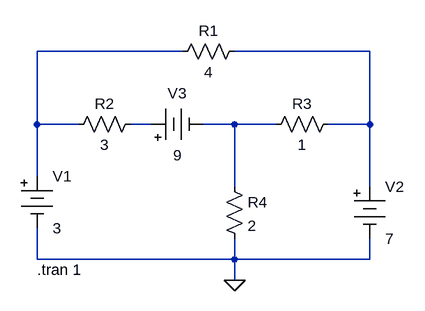
[diagram p0: schematic g3_p3.asc]
g3_p3.asc, the LTspice schematic file:
Version 4
SHEET 1 880 680
WIRE 176 -16 -48 -16
WIRE 464 -16 256 -16
WIRE -48 96 -48 -16
WIRE 16 96 -48 96
WIRE 128 96 96 96
WIRE 256 96 208 96
WIRE 320 96 256 96
WIRE 464 96 464 -16
WIRE 464 96 400 96
WIRE -48 176 -48 96
WIRE 256 192 256 96
WIRE 464 192 464 96
WIRE -48 304 -48 256
WIRE 256 304 256 272
WIRE 256 304 -48 304
WIRE 464 304 464 272
WIRE 464 304 256 304
WIRE 256 336 256 304
FLAG 256 336 0
SYMBOL res 160 0 R270
WINDOW 0 32 56 VTop 2
WINDOW 3 0 56 VBottom 2
SYMATTR InstName R1
SYMATTR Value 4
SYMBOL res 0 112 R270
WINDOW 0 32 56 VTop 2
WINDOW 3 0 56 VBottom 2
SYMATTR InstName R2
SYMATTR Value 3
SYMBOL res 416 80 R90
WINDOW 0 0 56 VBottom 2
WINDOW 3 32 56 VTop 2
SYMATTR InstName R3
SYMATTR Value 1
SYMBOL Misc\\battery -48 160 R0
WINDOW 123 0 0 Left 0
WINDOW 39 0 0 Left 0
SYMATTR InstName V1
SYMATTR Value 3
SYMBOL Misc\\battery 464 176 R0
WINDOW 123 0 0 Left 0
WINDOW 39 0 0 Left 0
SYMATTR InstName V2
SYMATTR Value 7
SYMBOL Misc\\battery 112 96 R270
WINDOW 0 32 56 VTop 2
WINDOW 3 -32 56 VBottom 2
WINDOW 123 0 0 Left 0
WINDOW 39 0 0 Left 0
SYMATTR InstName V3
SYMATTR Value 9
SYMBOL res 240 176 R0
SYMATTR InstName R4
SYMATTR Value 2
TEXT -48 320 Left 2 !.tran 1

The netlist it stands for:
* g3_p3.asc
R1 N001 N002 4
R2 N001 N003 3
R3 N002 N004 1
V1 N001 0 3
V2 N002 0 7
V3 N003 N004 9
R4 N004 0 2
.tran 1
.backanno
.end